# EAGLE design MAX1493 (EAGLE 6.5.0)

## Sheet 1 of 2

## Sheet 2 of 2
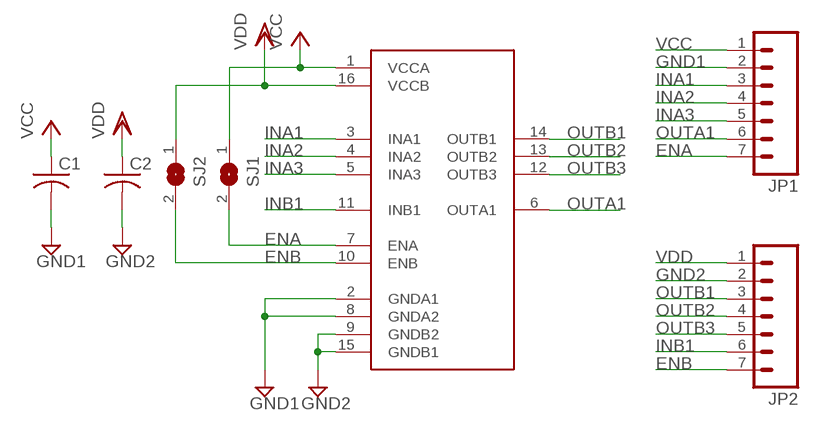
[diagram p0: schematic, sheet 2]

### Parts
C1  C-USC0805  [C0805]
C2  C-USC0805  [C0805]
JP1  M07LOCK  [1X07_LOCK]
JP2  M07LOCK  [1X07_LOCK]
SJ1  SJ  [SJ]
SJ2  SJ  [SJ]
U$1  MAX14931  [SO16]

### Nets
ENA: JP1.7 SJ1.2 U$1.7(ENA)
ENB: JP2.7 SJ2.2 U$1.10(ENB)
GND1: C1.2 JP1.2 U$1.2(GNDA1) U$1.8(GNDA2)
GND2: C2.2 JP2.2 U$1.9(GNDB2) U$1.15(GNDB1)
INA1: JP1.3 U$1.3(INA1)
INA2: JP1.4 U$1.4(INA2)
INA3: JP1.5 U$1.5(INA3)
INB1: JP2.6 U$1.11(INB1)
OUTA1: JP1.6 U$1.6(OUTA1)
OUTB1: JP2.3 U$1.14(OUTB1)
OUTB2: JP2.4 U$1.13(OUTB2)
OUTB3: JP2.5 U$1.12(OUTB3)
VCC: C1.1 JP1.1 SJ1.1 U$1.1(VCCA)
VDD: C2.1 JP2.1 SJ2.1 U$1.16(VCCB)

## Library data of the parts
C1 C2 = rcl:C-US: CAPACITOR, American symbol
JP1 JP2 = SparkFun-Connectors:M07: Header 7 Standard 7-pin 0.1" header. Use with straight break away headers (SKU : PRT-00116), right angle break away headers (PRT-00553), swiss pins (PRT-00743), machine pins (PRT-00117), and female headers (PRT-00115). NOTES ON THE VARIANTS LOCK and LOCK_LONGPADS... This footprint was designed to help hold the alignment of a through-hole component (i.e. 7-pin header) while soldering it into place. You may notice that each hole has been shifted either up or down by 0.005 of an inch from it's more standard position (which is usually a perfectly straight line). This slight alteration caused the pins (the squares in the middle) to touch the edges of the holes. Because they are alternating, it causes a "brace" to hold the header in place. 0.005 has proven to be the perfect amount of "off-center" position when using our standard breakaway headers. Although looks a little odd when you look at the bare footprint, once you have a header in there, the alteration is very hard to notice. Also, if you push a header all the way into place, it is covered up entirely on the bottom side. This idea of altering the position of holes to aid alignment will be further integrated into the Sparkfun Library for other footprints. It can help hold any component with 3 or more connection pins.
SJ1 SJ2 = jumper:SJ: SMD solder JUMPER
U$1 = maxim:MAX14931

## Board
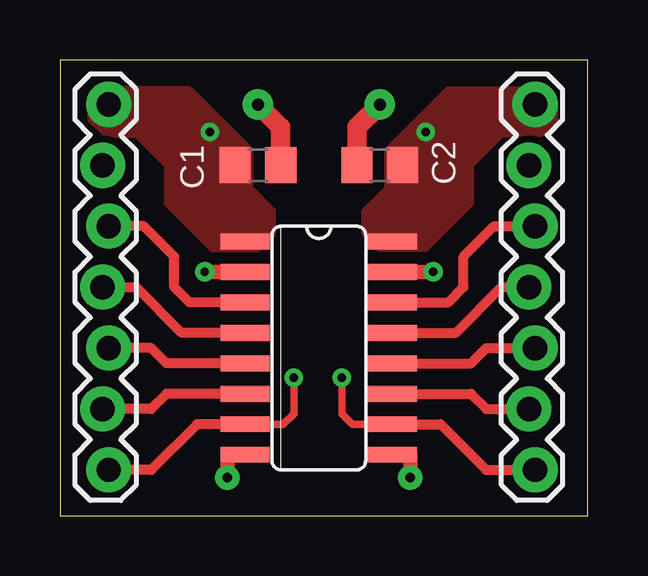
[diagram p1: board, top side]
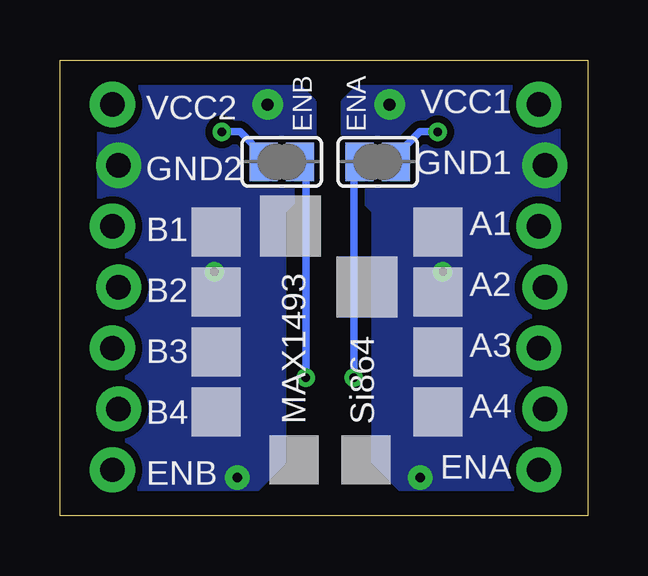
[diagram p2: board, bottom side, seen from below]

Size 22 x 19 mm. Coordinates in mm from the lower left corner, seen from the top.
Outline: 0,0 22,0 22,19 0,19 0,0
Copper layers (1*16): Top 0.035mm / dielectric 1.5mm / Bottom 0.035mm
Design rules "default": minimum track width 10mil, minimum drill 24mil, track to track 8mil, track to pad 8mil, pad to pad 8mil, via to via 8mil, smd to smd 8mil, copper to edge 40mil, drill to drill 8mil, minimum pad ring 10mil, minimum via ring 8mil, stop-mask expansion 4mil, vias tented up to drill 0mil, thermal gap 10mil

### Footprints (pad centres in the part's own frame; a part is rotated, then mirrored left to right if it is on the bottom)
C0805 = smd 1.3 x 1.5: 1 -0.95,0; 2 0.95,0
1X07_LOCK = drill 1.016 pad 1.88: 1 0,0.127; 2 2.54,-0.127; 3 5.08,0.127; 4 7.62,-0.127; 5 10.16,0.127; 6 12.7,-0.127; 7 15.24,0.127
SJ = smd 1.168 x 1.6: 1 -0.762,0; 2 0.762,0
SO16 = smd 0.66 x 2.032: 1 -4.445,-3.073; 2 -3.175,-3.073; 3 -1.905,-3.073; 4 -0.635,-3.073; 5 0.635,-3.073; 6 1.905,-3.073; 7 3.175,-3.073; 8 4.445,-3.073; 9 4.445,3.073; 10 3.175,3.073; 11 1.905,3.073; 12 0.635,3.073; 13 -0.635,3.073; 14 -1.905,3.073; 15 -3.175,3.073; 16 -4.445,3.073

### Placement (x,y rotation side)
C1  8.26,14.6 0 top
C2  13.34,14.6 180 top
JP1  1.91,17.14 270 top
JP2  19.68,17.14 270 top
SJ1  8.75,14.75 180 bottom
SJ2  12.75,14.75 0 bottom
U$1  10.79,6.99 270 top

### Tracks (layer width: path | path; a pad name or v marks a point on that pad's centre or on a via)
ENA  (via drill 0.35)
  Top 0.305: v9.75,5.75 9.75,4.25 9.31,3.81 U$1.7
  Top 0.406: U$1.7 5.71,3.81 3.81,1.91 JP1.7
  Bottom 0.305: v9.75,5.75 9.75,14.51 SJ1.2
ENB  (via drill 0.35)
  Top 0.305: v11.75,5.75 11.75,4.25 12.19,3.81 U$1.10
  Top 0.406: U$1.10 15.88,3.81 17.78,1.91 JP2.7
  Bottom 0.305: v11.75,5.75 11.75,14.51 SJ2.2
GND1  (via drill 0.35 pad 0.81, 0.4 pad 1.02, 0.5 pad 1.27)
  Top 0.61: U$1.2 v6.03,10.16 | U$1.8 6.99,2.54 v6.99,1.59
  Top 0.813: v8.26,17.14 9.21,16.19 C1.2
  pour Bottom (isolate 0.305, no thermals): 8.89,18.53 2.54,18.53 1.27,17.26 1.27,2.22 2.54,0.95 7.62,0.95 8.89,2.22 8.89,12.7 10.16,13.97 10.16,17.26
GND2  (via drill 0.35 pad 0.81, 0.4 pad 1.02, 0.5 pad 1.27)
  Top 0.61: U$1.15 v15.56,10.16 | U$1.9 14.61,2.54 v14.61,1.59
  Top 0.813: v13.34,17.14 12.38,16.19 C2.2
  pour Bottom (isolate 0.305, no thermals): 19.05,18.53 12.7,18.53 11.43,17.26 11.43,13.97 12.7,12.7 12.7,2.22 13.97,0.95 19.05,0.95 20.32,2.22 20.32,17.26
INA1
  Top 0.406: U$1.3 5.4,8.89 4.76,9.52 4.76,10.79 3.49,12.06 JP1.3
INA2
  Top 0.406: U$1.4 5.08,7.62 3.17,9.52 JP1.4
INA3
  Top 0.406: U$1.5 4.45,6.35 3.81,6.99 JP1.5
INB1
  Top 0.406: U$1.11 17.14,5.08 17.78,4.45 JP2.6
OUTA1
  Top 0.406: U$1.6 4.45,5.08 3.81,4.45 JP1.6
OUTB1
  Top 0.406: U$1.14 16.19,8.89 16.83,9.52 16.83,10.79 18.1,12.06 JP2.3
OUTB2
  Top 0.406: U$1.13 16.51,7.62 18.41,9.52 JP2.4
OUTB3
  Top 0.406: U$1.12 17.14,6.35 17.78,6.99 JP2.5
VCC  (via drill 0.35)
  Bottom 0.305: SJ1.1 7.99,15.01 7,16 v6.25,16
  pour Top (isolate 0.305, no thermals): 5.4,17.78 1.91,17.78 1.27,17.14 1.27,16.51 1.91,15.88 3.17,15.88 4.45,14.6 4.45,13.02 6.35,11.11 8.26,11.11 8.89,11.75 8.89,12.7 7.94,13.65 7.94,15.24
VDD  (via drill 0.35)
  Bottom 0.305: SJ2.1 13.51,15.01 14.5,16 v15.25,16
  pour Top (isolate 0.305, no thermals): 16.19,17.78 20,17.78 20.64,17.14 20.64,16.51 20,15.88 18.41,15.88 17.14,14.6 17.14,13.02 15.24,11.11 13.34,11.11 12.7,11.75 12.7,12.7 13.65,13.65 13.65,15.24

### Text on the board
bPlace: VCC1 | ENA | ENB | VCC2 | GND1 | GND2 | A1 | B1 | A2 | B2 | A3 | B3 | A4 | Si864 | MAX1493 | B4 | ENA | ENB